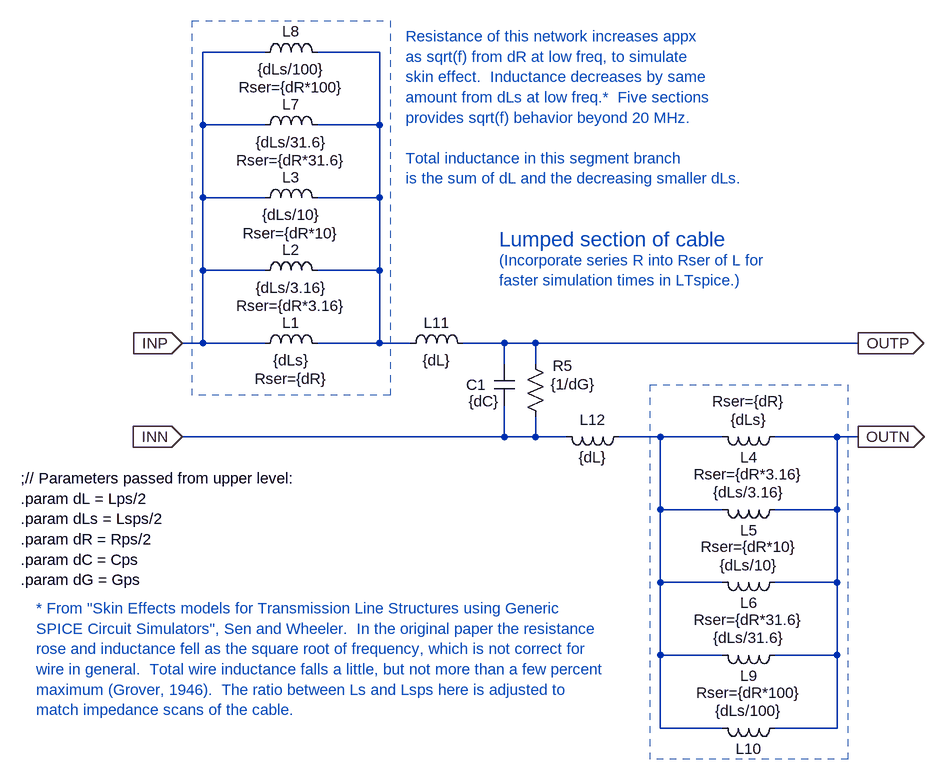
[diagram p0: schematic LineSegment.asc]
LineSegment.asc, the LTspice schematic file:
Version 4
SHEET 1 880 1020
WIRE -1040 -96 -1136 -96
WIRE -864 -96 -960 -96
WIRE -1136 16 -1136 -96
WIRE -1040 16 -1136 16
WIRE -864 16 -864 -96
WIRE -864 16 -960 16
WIRE -1136 128 -1136 16
WIRE -1040 128 -1136 128
WIRE -864 128 -864 16
WIRE -864 128 -960 128
WIRE -1136 240 -1136 128
WIRE -1040 240 -1136 240
WIRE -864 240 -864 128
WIRE -864 240 -960 240
WIRE -1136 352 -1136 240
WIRE -1136 352 -1168 352
WIRE -1040 352 -1136 352
WIRE -864 352 -864 240
WIRE -864 352 -960 352
WIRE -816 352 -864 352
WIRE -672 352 -736 352
WIRE -624 352 -672 352
WIRE -128 352 -624 352
WIRE -672 384 -672 352
WIRE -624 384 -624 352
WIRE -672 496 -672 448
WIRE -672 496 -1168 496
WIRE -624 496 -624 464
WIRE -624 496 -672 496
WIRE -576 496 -624 496
WIRE -432 496 -496 496
WIRE -336 496 -432 496
WIRE -160 496 -256 496
WIRE -128 496 -160 496
WIRE -432 608 -432 496
WIRE -336 608 -432 608
WIRE -160 608 -160 496
WIRE -160 608 -256 608
WIRE -432 720 -432 608
WIRE -336 720 -432 720
WIRE -160 720 -160 608
WIRE -160 720 -256 720
WIRE -432 832 -432 720
WIRE -336 832 -432 832
WIRE -160 832 -160 720
WIRE -160 832 -256 832
WIRE -432 944 -432 832
WIRE -336 944 -432 944
WIRE -160 944 -160 832
WIRE -160 944 -256 944
FLAG -1168 352 INP
IOPIN -1168 352 In
FLAG -1168 496 INN
IOPIN -1168 496 In
FLAG -128 352 OUTP
IOPIN -128 352 Out
FLAG -128 496 OUTN
IOPIN -128 496 Out
SYMBOL ind -1056 368 R270
WINDOW 0 32 56 VTop 2
WINDOW 3 5 56 VBottom 2
WINDOW 39 -23 56 VBottom 2
SYMATTR InstName L1
SYMATTR Value {dLs}
SYMATTR SpiceLine Rser={dR}
SYMBOL cap -688 384 R0
WINDOW 0 -43 32 Left 2
WINDOW 3 -39 57 Left 2
SYMATTR InstName C1
SYMATTR Value {dC}
SYMBOL res -640 368 R0
WINDOW 0 42 19 Left 2
WINDOW 3 39 47 Left 2
SYMATTR InstName R5
SYMATTR Value {1/dG}
SYMBOL ind -1056 256 R270
WINDOW 0 32 56 VTop 2
WINDOW 3 5 56 VBottom 2
WINDOW 39 -23 56 VBottom 2
SYMATTR InstName L2
SYMATTR Value {dLs/3.16}
SYMATTR SpiceLine Rser={dR*3.16}
SYMBOL ind -1056 144 R270
WINDOW 0 32 56 VTop 2
WINDOW 3 5 56 VBottom 2
WINDOW 39 -23 56 VBottom 2
SYMATTR InstName L3
SYMATTR Value {dLs/10}
SYMATTR SpiceLine Rser={dR*10}
SYMBOL ind -1056 32 R270
WINDOW 0 32 56 VTop 2
WINDOW 3 5 56 VBottom 2
WINDOW 39 -23 56 VBottom 2
SYMATTR InstName L7
SYMATTR Value {dLs/31.6}
SYMATTR SpiceLine Rser={dR*31.6}
SYMBOL ind -1056 -80 R270
WINDOW 0 32 56 VTop 2
WINDOW 3 5 56 VBottom 2
WINDOW 39 -23 56 VBottom 2
SYMATTR InstName L8
SYMATTR Value {dLs/100}
SYMATTR SpiceLine Rser={dR*100}
SYMBOL ind -832 368 R270
WINDOW 0 32 56 VTop 2
WINDOW 3 5 56 VBottom 2
SYMATTR InstName L11
SYMATTR Value {dL}
SYMBOL ind -480 480 R90
WINDOW 0 5 56 VBottom 2
WINDOW 3 32 56 VTop 2
SYMATTR InstName L12
SYMATTR Value {dL}
SYMBOL ind -240 480 R90
WINDOW 0 32 56 VTop 2
WINDOW 3 5 56 VBottom 2
WINDOW 39 -23 56 VBottom 2
SYMATTR InstName L4
SYMATTR Value {dLs}
SYMATTR SpiceLine Rser={dR}
SYMBOL ind -240 592 R90
WINDOW 0 32 56 VTop 2
WINDOW 3 5 56 VBottom 2
WINDOW 39 -23 56 VBottom 2
SYMATTR InstName L5
SYMATTR Value {dLs/3.16}
SYMATTR SpiceLine Rser={dR*3.16}
SYMBOL ind -240 704 R90
WINDOW 0 32 56 VTop 2
WINDOW 3 5 56 VBottom 2
WINDOW 39 -23 56 VBottom 2
SYMATTR InstName L6
SYMATTR Value {dLs/10}
SYMATTR SpiceLine Rser={dR*10}
SYMBOL ind -240 816 R90
WINDOW 0 32 56 VTop 2
WINDOW 3 5 56 VBottom 2
WINDOW 39 -23 56 VBottom 2
SYMATTR InstName L9
SYMATTR Value {dLs/31.6}
SYMATTR SpiceLine Rser={dR*31.6}
SYMBOL ind -240 928 R90
WINDOW 0 32 56 VTop 2
WINDOW 3 5 56 VBottom 2
WINDOW 39 -23 56 VBottom 2
SYMATTR InstName L10
SYMATTR Value {dLs/100}
SYMATTR SpiceLine Rser={dR*100}
TEXT -680 192 Left 3 ;Lumped section of cable
TEXT -1416 560 Left 2 !;// Parameters passed from upper level:\n.param dL = Lps/2\n.param dLs = Lsps/2\n.param dR = Rps/2\n.param dC = Cps\n.param dG = Gps
TEXT -824 -120 Left 2 ;Resistance of this network increases appx\nas sqrt(f) from dR at low freq, to simulate \nskin effect.  Inductance decreases by same \namount from dLs at low freq.*  Five sections\nprovides sqrt(f) behavior beyond 20 MHz.\n \nTotal inductance in this segment branch \nis the sum of dL and the decreasing smaller dLs.
TEXT -1392 760 Left 2 ;* From "Skin Effects models for Transmission Line Structures using Generic\nSPICE Circuit Simulators", Sen and Wheeler.  In the original paper the resistance\nrose and inductance fell as the square root of frequency, which is not correct for\nwire in general.  Total wire inductance falls a little, but not more than a few percent \nmaximum (Grover, 1946).  The ratio between Ls and Lsps here is adjusted to \nmatch impedance scans of the cable.
TEXT -680 224 Left 2 ;(Incorporate series R into Rser of L for \nfaster simulation times in LTspice.)
RECTANGLE Normal -848 432 -1152 -144 2
RECTANGLE Normal -448 416 -144 992 2

The netlist it stands for:
* LineSegment.asc
L1 INP N001 {dLs} Rser={dR}
C1 OUTP INN {dC}
R5 OUTP INN {1/dG}
L2 INP N001 {dLs/3.16} Rser={dR*3.16}
L3 INP N001 {dLs/10} Rser={dR*10}
L7 INP N001 {dLs/31.6} Rser={dR*31.6}
L8 INP N001 {dLs/100} Rser={dR*100}
L11 N001 OUTP {dL}
L12 N002 INN {dL}
L4 OUTN N002 {dLs} Rser={dR}
L5 OUTN N002 {dLs/3.16} Rser={dR*3.16}
L6 OUTN N002 {dLs/10} Rser={dR*10}
L9 OUTN N002 {dLs/31.6} Rser={dR*31.6}
L10 OUTN N002 {dLs/100} Rser={dR*100}
* Lumped section of cable
;// Parameters passed from upper level:
.param dL = Lps/2
.param dLs = Lsps/2
.param dR = Rps/2
.param dC = Cps
.param dG = Gps
* Resistance of this network increases appx
* as sqrt(f) from dR at low freq, to simulate
* skin effect.  Inductance decreases by same
* amount from dLs at low freq.*  Five sections
* provides sqrt(f) behavior beyond 20 MHz.
* Total inductance in this segment branch
* is the sum of dL and the decreasing smaller dLs.
* * From "Skin Effects models for Transmission Line Structures using Generic
* SPICE Circuit Simulators", Sen and Wheeler.  In the original paper the resistance
* rose and inductance fell as the square root of frequency, which is not correct for
* wire in general.  Total wire inductance falls a little, but not more than a few percent
* maximum (Grover, 1946).  The ratio between Ls and Lsps here is adjusted to
* match impedance scans of the cable.
* (Incorporate series R into Rser of L for
* faster simulation times in LTspice.)
.backanno
.end